# Altium schematic sheet Principine_schema.SchDoc
size A4; SheetNumber: 1; SheetTotal: 1
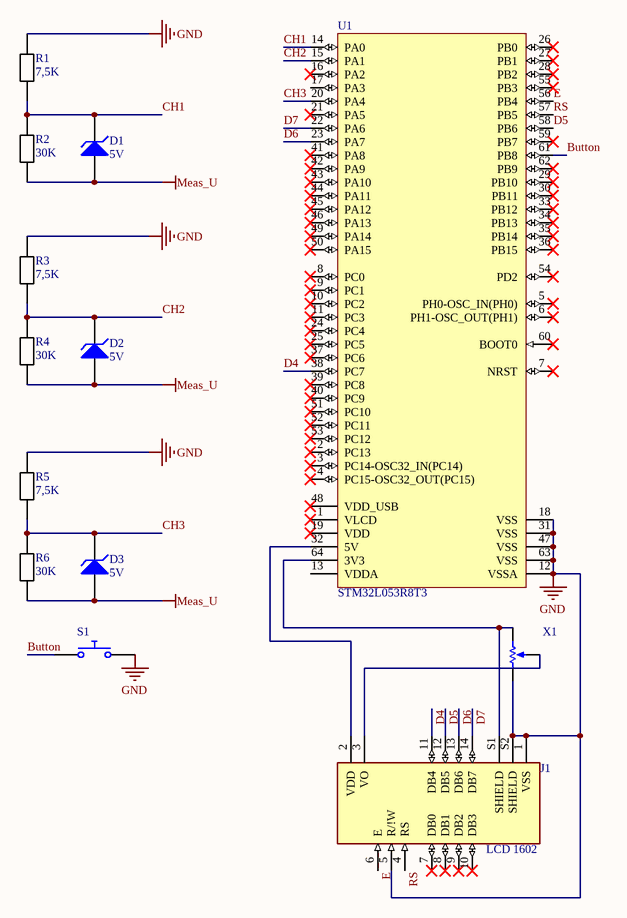
[diagram p0: Principine_schema.SchDoc]

## Parts
D1  BV: 5V  (hidden comment: Zener Diode)
D2  BV: 5V  (hidden comment: Zener Diode)
D3  BV: 5V  (hidden comment: Zener Diode)
J1  LCD 1602  [LCD_LCM-S01602DTR/M]
R1  7,5K
R2  30K
R3  7,5K
R4  30K
R5  7,5K
R6  30K
S1  Push Button Normally Opened  (value not drawn)
U1  STM32L053R8T3  [STM-LQFP64_L]
X1  Potentiometer  (value not drawn)

## Nets
GND: J1.1(VSS) J1.5(R/!W) J1.S2(SHIELD) R1.?1 R3.?1 R5.?1 S1.2 U1.12(VSSA) U1.18(VSS) U1.31(VSS) U1.47(VSS) U1.63(VSS) X1.1(TOP)
Meas_U: D1.1(A) D2.1(A) D3.1(A) R2.?2 R4.?2 R6.?2
Button: S1.1 U1.61(PB8)
CH1: D1.2(K) R1.?2 R2.?1 U1.14(PA0)
CH2: D2.2(K) R3.?2 R4.?1 U1.15(PA1)
CH3: D3.2(K) R5.?2 R6.?1 U1.20(PA4)
D4: J1.11(DB4) U1.38(PC7)
D5: J1.12(DB5) U1.58(PB6)
D6: J1.13(DB6) U1.23(PA7)
D7: J1.14(DB7) U1.22(PA6)
E: J1.6(E) U1.56(PB4)
RS: J1.4(RS) U1.57(PB5)
NetJ1_2: J1.2(VDD) U1.32(5V)
NetJ1_3: J1.3(VO) X1.3(TAP)
NetJ1_S1: J1.S1(SHIELD) U1.64(3V3) X1.2(BOT)

Not connected (* = marked no-connect by the designer): J1 7(DB0)* 8(DB1)* 9(DB2)* 10(DB3)*; U1 1(VLCD)* 2(PC13)* 3(PC14-OSC32_IN(PC14))* 4(PC15-OSC32_OUT(PC15))* 5(PH0-OSC_IN(PH0))* 6(PH1-OSC_OUT(PH1))* 7(NRST)* 8(PC0)* 9(PC1)* 10(PC2)* 11(PC3)* 13(VDDA) 16(PA2)* 17(PA3) 19(VDD)* 21(PA5)* 24(PC4)* 25(PC5)* 26(PB0)* 27(PB1)* 28(PB2)* 29(PB10)* 30(PB11)* 33(PB12)* 34(PB13)* 35(PB14)* 36(PB15)* 37(PC6)* 39(PC8)* 40(PC9)* 41(PA8)* 42(PA9)* 43(PA10)* 44(PA11)* 45(PA12)* 46(PA13)* 48(VDD_USB)* 49(PA14)* 50(PA15)* 51(PC10)* 52(PC11)* 53(PC12)* 54(PD2)* 55(PB3)* 59(PB7)* 60(BOOT0)* 62(PB9)*

## Library data of the parts
D1-D3 = Zener Diode: AF: 1; BV_MAX: 1e99; CJO: 0; EG: 1.11; FC: 0.5; IBV: 0.001; IS: 1e-14; MJSW: 0.33; NTUN: 30; TNOM: 27; XTI: 3; SimulationGenericComponent: True; CJP: 0; CTA: 0; CTP: 0; FCS: 0.5; FV_MAX: 1e99; IKF: 0; IKR: 0; ISR: 1e-14; JSW: 0; JTUN: 0; JTUNSW: 0; KEG: 1; KF: 0; LEVEL: 1; N: 1; NBV: 1; NR: 1; NS: 1; PHP: 1; RS: 0; TCV: 0; TLEV: 0; TLEVC: 0; TM1: 0; TM2: 0; TPB: 0; TPHP: 0; TRS: 0; TRS2: 0; TT: 0; TTT1: 0; TTT2: 0; VJ: 1; XTITUN: 3
J1 = LCM-S01602DTR/M: MF: Lumex Opto/Components; SnapEDA_Link: https://www.snapeda.com/parts/LCM-S01602DTR/M/Lumex%20Opto/Components%20Inc./view-part/193570/?ref=snap; Availability: Good; Price: None; Package: None; DigiKey-Purchase-URL: https://snapeda.com/shop?store=DigiKey&id=193570; Value: *; MP: LCM-S01602DTR/M; Mouser-Purchase-URL: https://snapeda.com/shop?store=Mouser&id=193570
R1-R6 = Resistor
S1 = Push Button NO: closed: 0; Rclosed: 1m; Ropen: 1Meg; SimulationGenericComponent: True
U1 = CMP-1546-00062-1: Ultra-low-power 32-Bit MCU ARM-based Cortex-M0+, 64 KB Flash, 8 KB RAM, 51 I/Os, 64-Pin LQFP, -40 to 125 degC, Tray; Core: ARM Cortex-M0+; Operating Frequency(F) (Processor speed) (MHz): 32; FLASH Size (Prog) (kB): 64; Internal RAM Size (kB): 8; Data E2PROM nom (B): 2048; I/Os (High Current): 51; D/A Converter: 1; Supply Voltage(Vcc) min (V): 1.8; ComponentLink1Description: Manufacturer URL; ComponentLink1URL: http://www.st.com/; ComponentLink2Description: Datasheet; DatasheetVersion: Rev. 5; Package Description: 64-Pin Low-profile Quad Flat Package, Body 10 x 10 mm, Pitch 0.5 mm; Mounting Technology: Surface Mount; ComponentLink2URL: http://www.st.com/st-web-ui/static/active/en/resource/technical/document/datasheet/DM00105960.pdf; Packing: Tray; Package Reference: LQFP64
X1 = Potentiometer: value: 1k; position: 0.5; SimulationGenericComponent: True